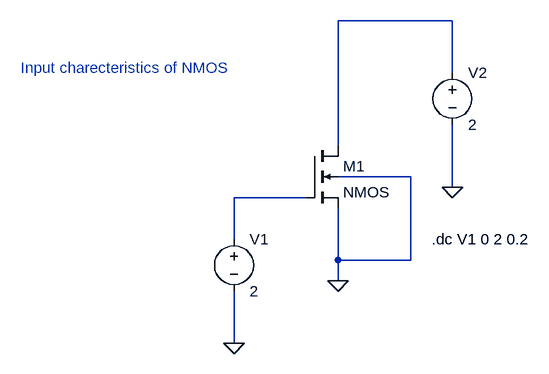
[diagram p0: schematic Draft6.asc]
Draft6.asc, the LTspice schematic file:
Version 4.1
SHEET 1 880 680
WIRE 416 -96 240 -96
WIRE 416 -16 416 -96
WIRE 240 96 240 -96
WIRE 352 144 240 144
WIRE 416 160 416 64
WIRE 192 176 80 176
WIRE 80 240 80 176
WIRE 240 272 240 192
WIRE 352 272 352 144
WIRE 352 272 240 272
WIRE 240 304 240 272
WIRE 80 400 80 320
FLAG 80 400 0
FLAG 240 304 0
FLAG 416 160 0
SYMBOL nmos4 192 96 R0
SYMATTR InstName M1
SYMATTR Value2 l=1080nm w=1080nm
SYMBOL voltage 80 224 R0
WINDOW 123 0 0 Left 0
WINDOW 39 0 0 Left 0
SYMATTR InstName V1
SYMATTR Value 2
SYMBOL voltage 416 -32 R0
WINDOW 123 0 0 Left 0
WINDOW 39 0 0 Left 0
SYMATTR InstName V2
SYMATTR Value 2
TEXT 384 240 Left 2 !.dc V1 0 2 0.2
TEXT -248 -24 Left 2 ;Input charecteristics of NMOS

The netlist it stands for:
* Draft6.asc
M1 N001 N002 0 0 NMOS l=1080nm w=1080nm
V1 N002 0 2
V2 N001 0 2
.model NMOS NMOS
.model PMOS PMOS
.lib standard.mos
.dc V1 0 2 0.2
* Input charecteristics of NMOS
.backanno
.end